# EAGLE design DistanceSensor (EAGLE 7.3.0)
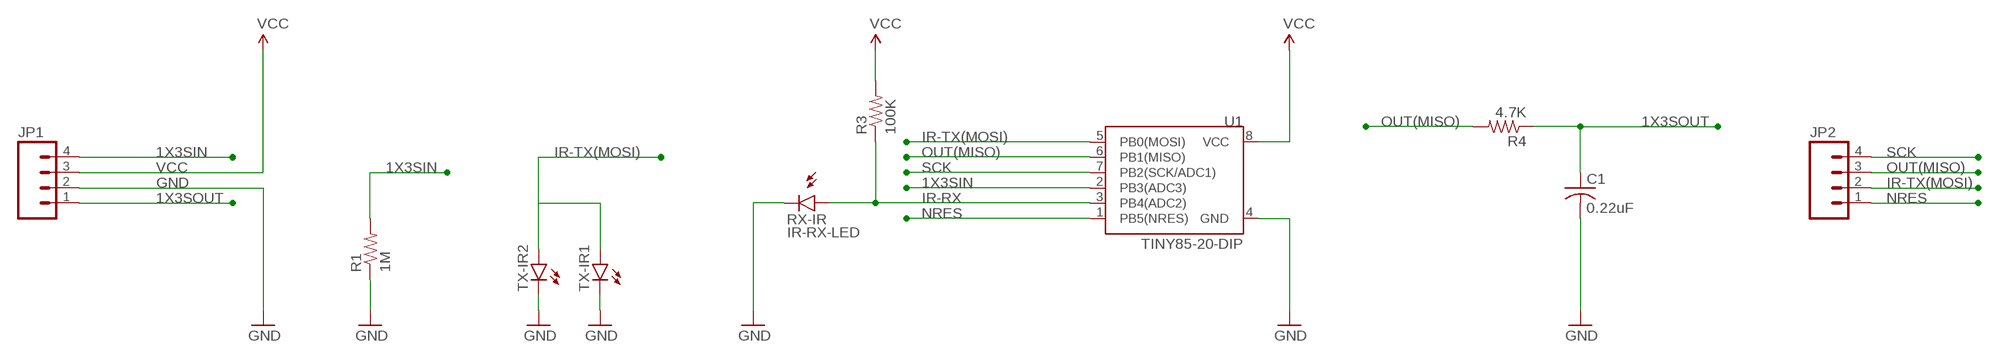
[diagram p0: schematic, sheet 1]

## Parts
C1  0.22uF  C-USC0603  [C0603]
JP1  M04PTH  [1X04]
JP2  M04PTH  [1X04]
R1  1M  R-US_R0603  [R0603]
R3  100K  R-US_R0603  [R0603]
R4  4.7K  R-US_R0603  [R0603]
RX-IR  IR-RX-LED  [LED5MM]
TX-IR1  LED5MM  [LED5MM]
TX-IR2  LED5MM  [LED5MM]
U1  TINY85-20-DIP  ATTINY45TINY85-20-DIP  [DIP08]

## Nets
1X3SIN: JP1.4 R1.2 U1.2(PB3(ADC3))
1X3SOUT: C1.1 JP1.1 R4.1
GND: C1.2 JP1.2 R1.1 RX-IR.K(C) TX-IR1.K(C) TX-IR2.K(C) U1.4(GND)
IR-RX: R3.1 RX-IR.A U1.3(PB4(ADC2))
IR-TX(MOSI): JP2.2 TX-IR1.A TX-IR2.A U1.5(PB0(MOSI))
NRES: JP2.1 U1.1(PB5(NRES))
OUT(MISO): JP2.3 R4.2 U1.6(PB1(MISO))
SCK: JP2.4 U1.7(PB2(SCK/ADC1))
VCC: JP1.3 R3.2 U1.8(VCC)

## Library data of the parts
C1 = adafruit:C-US: CAPACITOR, American symbol
JP1 JP2 = SparkFun-Connectors:M04: Header 4 Standard 4-pin 0.1" header. Use with straight break away headers (SKU : PRT-00116), right angle break away headers (PRT-00553), swiss pins (PRT-00743), machine pins (PRT-00117), and female headers (PRT-00115). Molex polarized connector foot print use with SKU : PRT-08231 with associated crimp pins and housings. 1MM SMD Version SKU: PRT-10208
R1 R3 R4 = adafruit:R-US_: RESISTOR, American symbol
RX-IR = SparkFun-LED:IR-RX-LED
TX-IR1 TX-IR2 = SparkFun-LED:LED: LEDs Standard schematic elements and footprints for 5mm, 3mm, 1206, and 0603 sized LEDs. 5mm - Spark Fun Electronics SKU : COM-00529 (and others)
U1 = SparkFun-DigitalIC:ATTINY45: Atmel 8-pin 2/4/8kB flash uC; PROD_ID: IC-09445

## Board
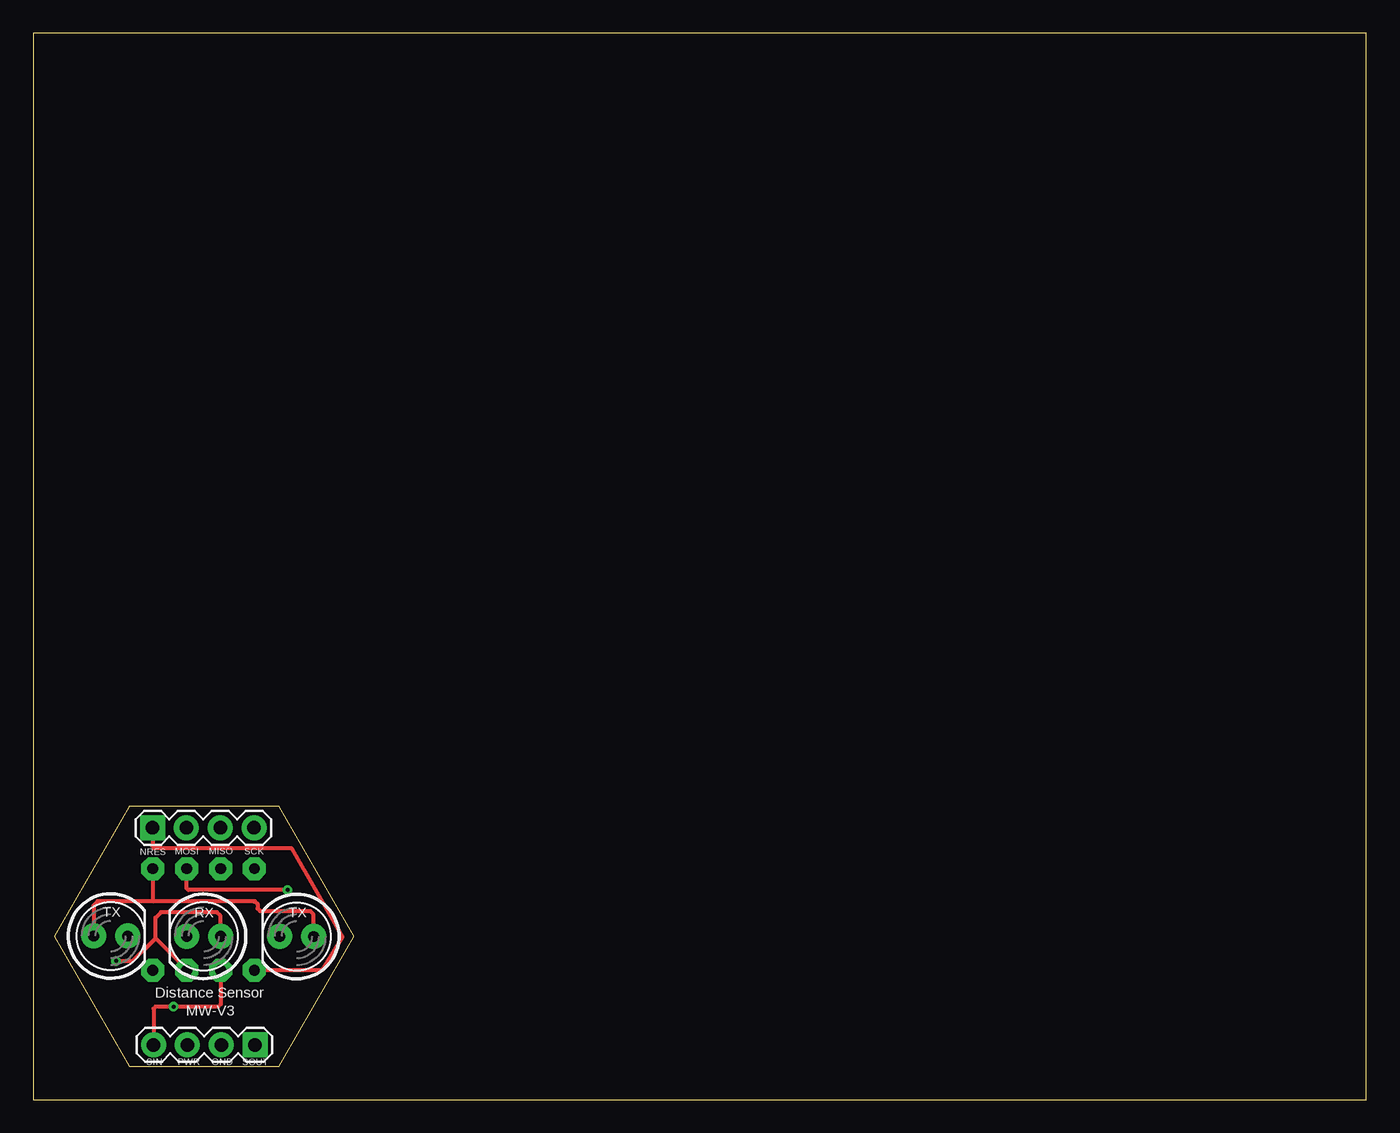
[diagram p1: board, top side]
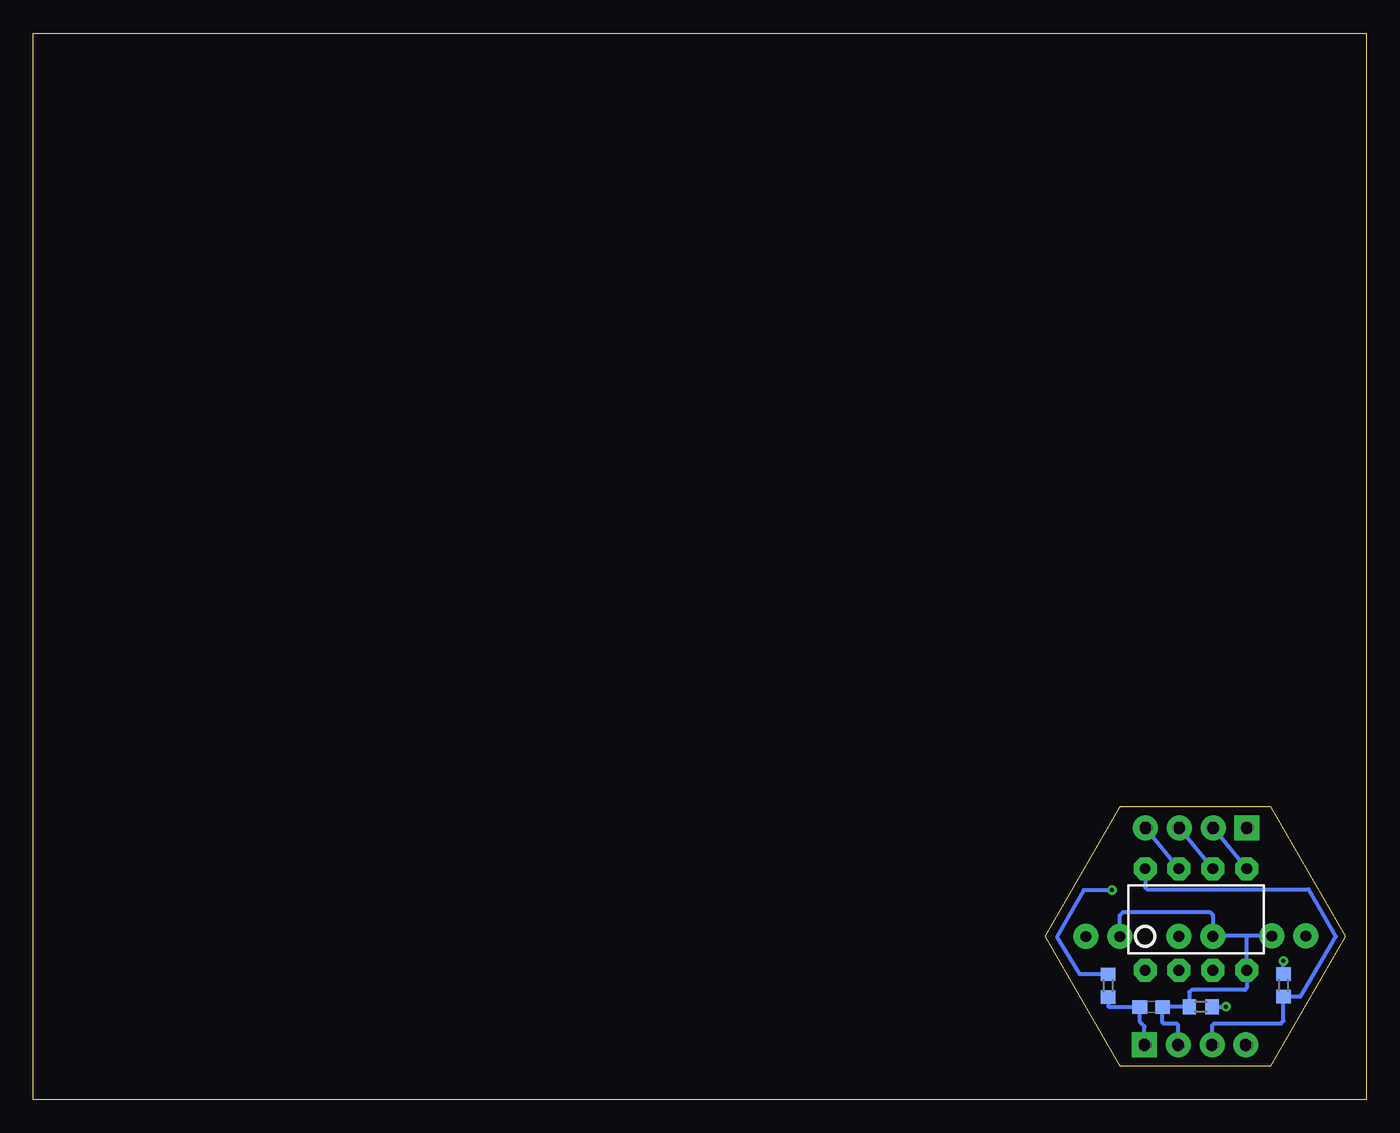
[diagram p2: board, bottom side, seen from below]

Size 100 x 80 mm. Coordinates in mm from the lower left corner, seen from the top.
Outline: 0,0 100,0 100,80 0,80 0,0
Outline: 7.18,2.5 18.43,2.5 24.05,12.24 18.43,21.98 7.18,21.98 1.55,12.24 7.18,2.5
Copper layers (1*16): Top 0.035mm / dielectric 1.5mm / Bottom 0.035mm
Design rules "default": minimum track width 10mil, minimum drill 24mil, track to track 8mil, track to pad 8mil, pad to pad 8mil, via to via 8mil, smd to smd 8mil, copper to edge 40mil, drill to drill 8mil, minimum pad ring 10mil, minimum via ring 8mil, stop-mask expansion 4mil, vias tented up to drill 0mil, thermal gap 10mil

### Footprints (pad centres in the part's own frame; a part is rotated, then mirrored left to right if it is on the bottom)
C0603 = smd 1.1 x 1: 1 -0.85,0; 2 0.85,0
1X04 = drill 1.016 pad 1.88 square: 1 0,0 | drill 1.016 pad 1.88: 2 2.54,0; 3 5.08,0; 4 7.62,0
R0603 = smd 1 x 1.1: 1 -0.85,0; 2 0.85,0
LED5MM = drill 0.813 pad 1.88: A -1.27,0; K 1.27,0
DIP08 = drill 0.813 pad 1.727 octagon: 1 -3.81,-3.81; 2 -1.27,-3.81; 3 1.27,-3.81; 4 3.81,-3.81; 5 3.81,3.81; 6 1.27,3.81; 7 -1.27,3.81; 8 -3.81,3.81

### Placement (x,y rotation side)
C1  16.13,6.95 0 bottom
JP1  16.64,4.1 180 top
JP2  8.94,20.38 0 top
R1  12.42,6.96 0 bottom
R3  6.21,8.57 270 bottom
R4  19.35,8.55 90 bottom
RX-IR  12.78,12.24 180 top
TX-IR1  5.8,12.27 0 top
TX-IR2  19.76,12.23 180 top
U1  12.78,13.51 0 bottom

### Tracks (layer width: path | path; a pad name or v marks a point on that pad's centre or on a via)
1X3SIN  (via drill 0.3 pad 0.25)
  Top 0.305: JP1.4 9.03,4.12 9.03,6.82 9.17,6.96 v10.52,6.96 13.88,6.96 14.05,7.12 U1.2
  Bottom 0.305: R1.2 v10.52,6.96
1X3SOUT
  Bottom 0.305: R4.1 19.36,7.02 19.28,6.95 C1.1 16.98,5.83 16.64,5.49 JP1.1
GND
  Bottom 0.305: JP1.2 14.1,5.58 14.21,5.69 15.18,5.69 15.28,5.79 C1.2 15.27,6.96 R1.1 | R1.1 13.27,8.05 13.09,8.23 9.11,8.23 8.97,8.37 U1.4 8.97,12.26 8.95,12.27 | R1.1 | TX-IR2.K 18.49,13.82 18.24,14.07 11.73,14.07 11.51,13.84 RX-IR.K 11.48,12.27 8.95,12.27 | TX-IR1.K 8.95,12.27
IR-RX  (via drill 0.3 pad 0.25)
  Top 0.305: RX-IR.A 14.05,13.77 13.77,14.05 9.58,14.05 9.16,13.63 9.16,12.11 | v6.21,10.39 7.44,10.39 9.16,12.11 | U1.3 11.51,9.77 9.16,12.11
  Bottom 0.305: R3.1 v6.21,10.39
IR-TX(MOSI)
  Top 0.305: TX-IR2.A 21.03,13.88 20.77,14.15 17,14.15 16.83,14.33 16.83,14.68 16.62,14.88 16.5,14.88 9.02,14.87 | 9.02,14.87 4.83,14.87 4.52,14.57 4.52,12.28 TX-IR1.A | U1.5 8.97,14.92 9.02,14.87
  Bottom 0.305: JP2.2 U1.5
NRES
  Top 0.305: JP2.1 8.94,19 9.07,18.87 19.38,18.87 23.19,12.22 21.68,9.7 U1.1
OUT(MISO)  (via drill 0.3 pad 0.25)
  Top 0.305: v19.06,15.72 11.63,15.72 11.49,15.86 11.49,17.31 U1.6
  Bottom 0.305: JP2.3 U1.6 | R4.2 21.49,9.4 23.19,12.21 21.18,15.72 v19.06,15.72
SCK
  Bottom 0.305: JP2.4 U1.7
VCC
  Bottom 0.305: JP1.3 11.56,5.55 11.39,5.71 6.4,5.71 6.21,5.91 R3.2 4.94,7.72 2.27,12.24 4.32,15.77 16.45,15.77 16.59,15.91 U1.8

### Text on the board
tPlace: NRES | MOSI | MISO | SCK | TX | RX | TX | Distance Sensor | MW-V3 | SIN | PWR | GND | SOUT